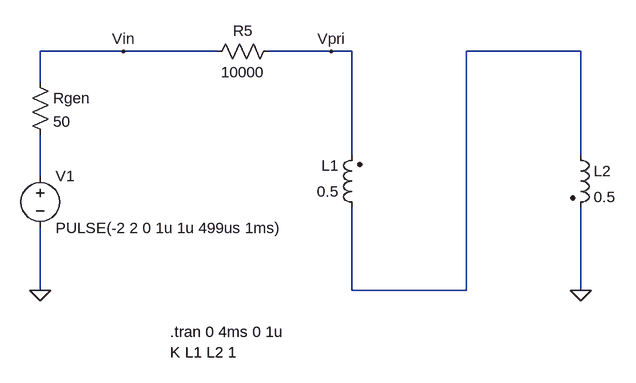
[diagram p0: schematic series_connected_coupled_inductors.asc]
series_connected_coupled_inductors.asc, the LTspice schematic file:
Version 4
SHEET 1 1004 680
WIRE 240 -64 112 -64
WIRE 384 -64 240 -64
WIRE 560 -64 464 -64
WIRE 592 -64 560 -64
WIRE 944 -64 768 -64
WIRE 112 -16 112 -64
WIRE 592 96 592 -64
WIRE 944 96 944 -64
WIRE 112 128 112 64
WIRE 112 304 112 208
WIRE 592 304 592 176
WIRE 768 304 768 -64
WIRE 768 304 592 304
WIRE 944 304 944 176
FLAG 112 304 0
FLAG 240 -64 Vin
FLAG 560 -64 Vpri
FLAG 944 304 0
SYMBOL voltage 112 112 R0
WINDOW 123 0 0 Left 0
WINDOW 39 0 0 Left 0
SYMATTR InstName V1
SYMATTR Value PULSE(-2 2 0 1u 1u 499us 1ms)
SYMBOL res 96 -32 R0
SYMATTR InstName Rgen
SYMATTR Value 50
SYMBOL res 480 -80 R90
WINDOW 0 0 56 VBottom 2
WINDOW 3 32 56 VTop 2
SYMATTR InstName R5
SYMATTR Value 10000
SYMBOL ind2 608 192 R180
WINDOW 0 36 80 Left 2
WINDOW 3 36 40 Left 2
SYMATTR InstName L1
SYMATTR Value 0.5
SYMATTR Type ind
SYMBOL ind2 928 80 R0
SYMATTR InstName L2
SYMATTR Value 0.5
SYMATTR Type ind
TEXT 312 368 Left 2 !.tran 0 4ms 0 1u\nK L1 L2 1

The netlist it stands for:
* series_connected_coupled_inductors.asc
V1 N002 0 PULSE(-2 2 0 1u 1u 499us 1ms)
Rgen Vin N002 50
R5 Vpri Vin 10000
L1 N001 Vpri 0.5
L2 N001 0 0.5
.tran 0 4ms 0 1u
K L1 L2 1
.backanno
.end